# EAGLE design BallDetector6A (EAGLE 6.5.0)
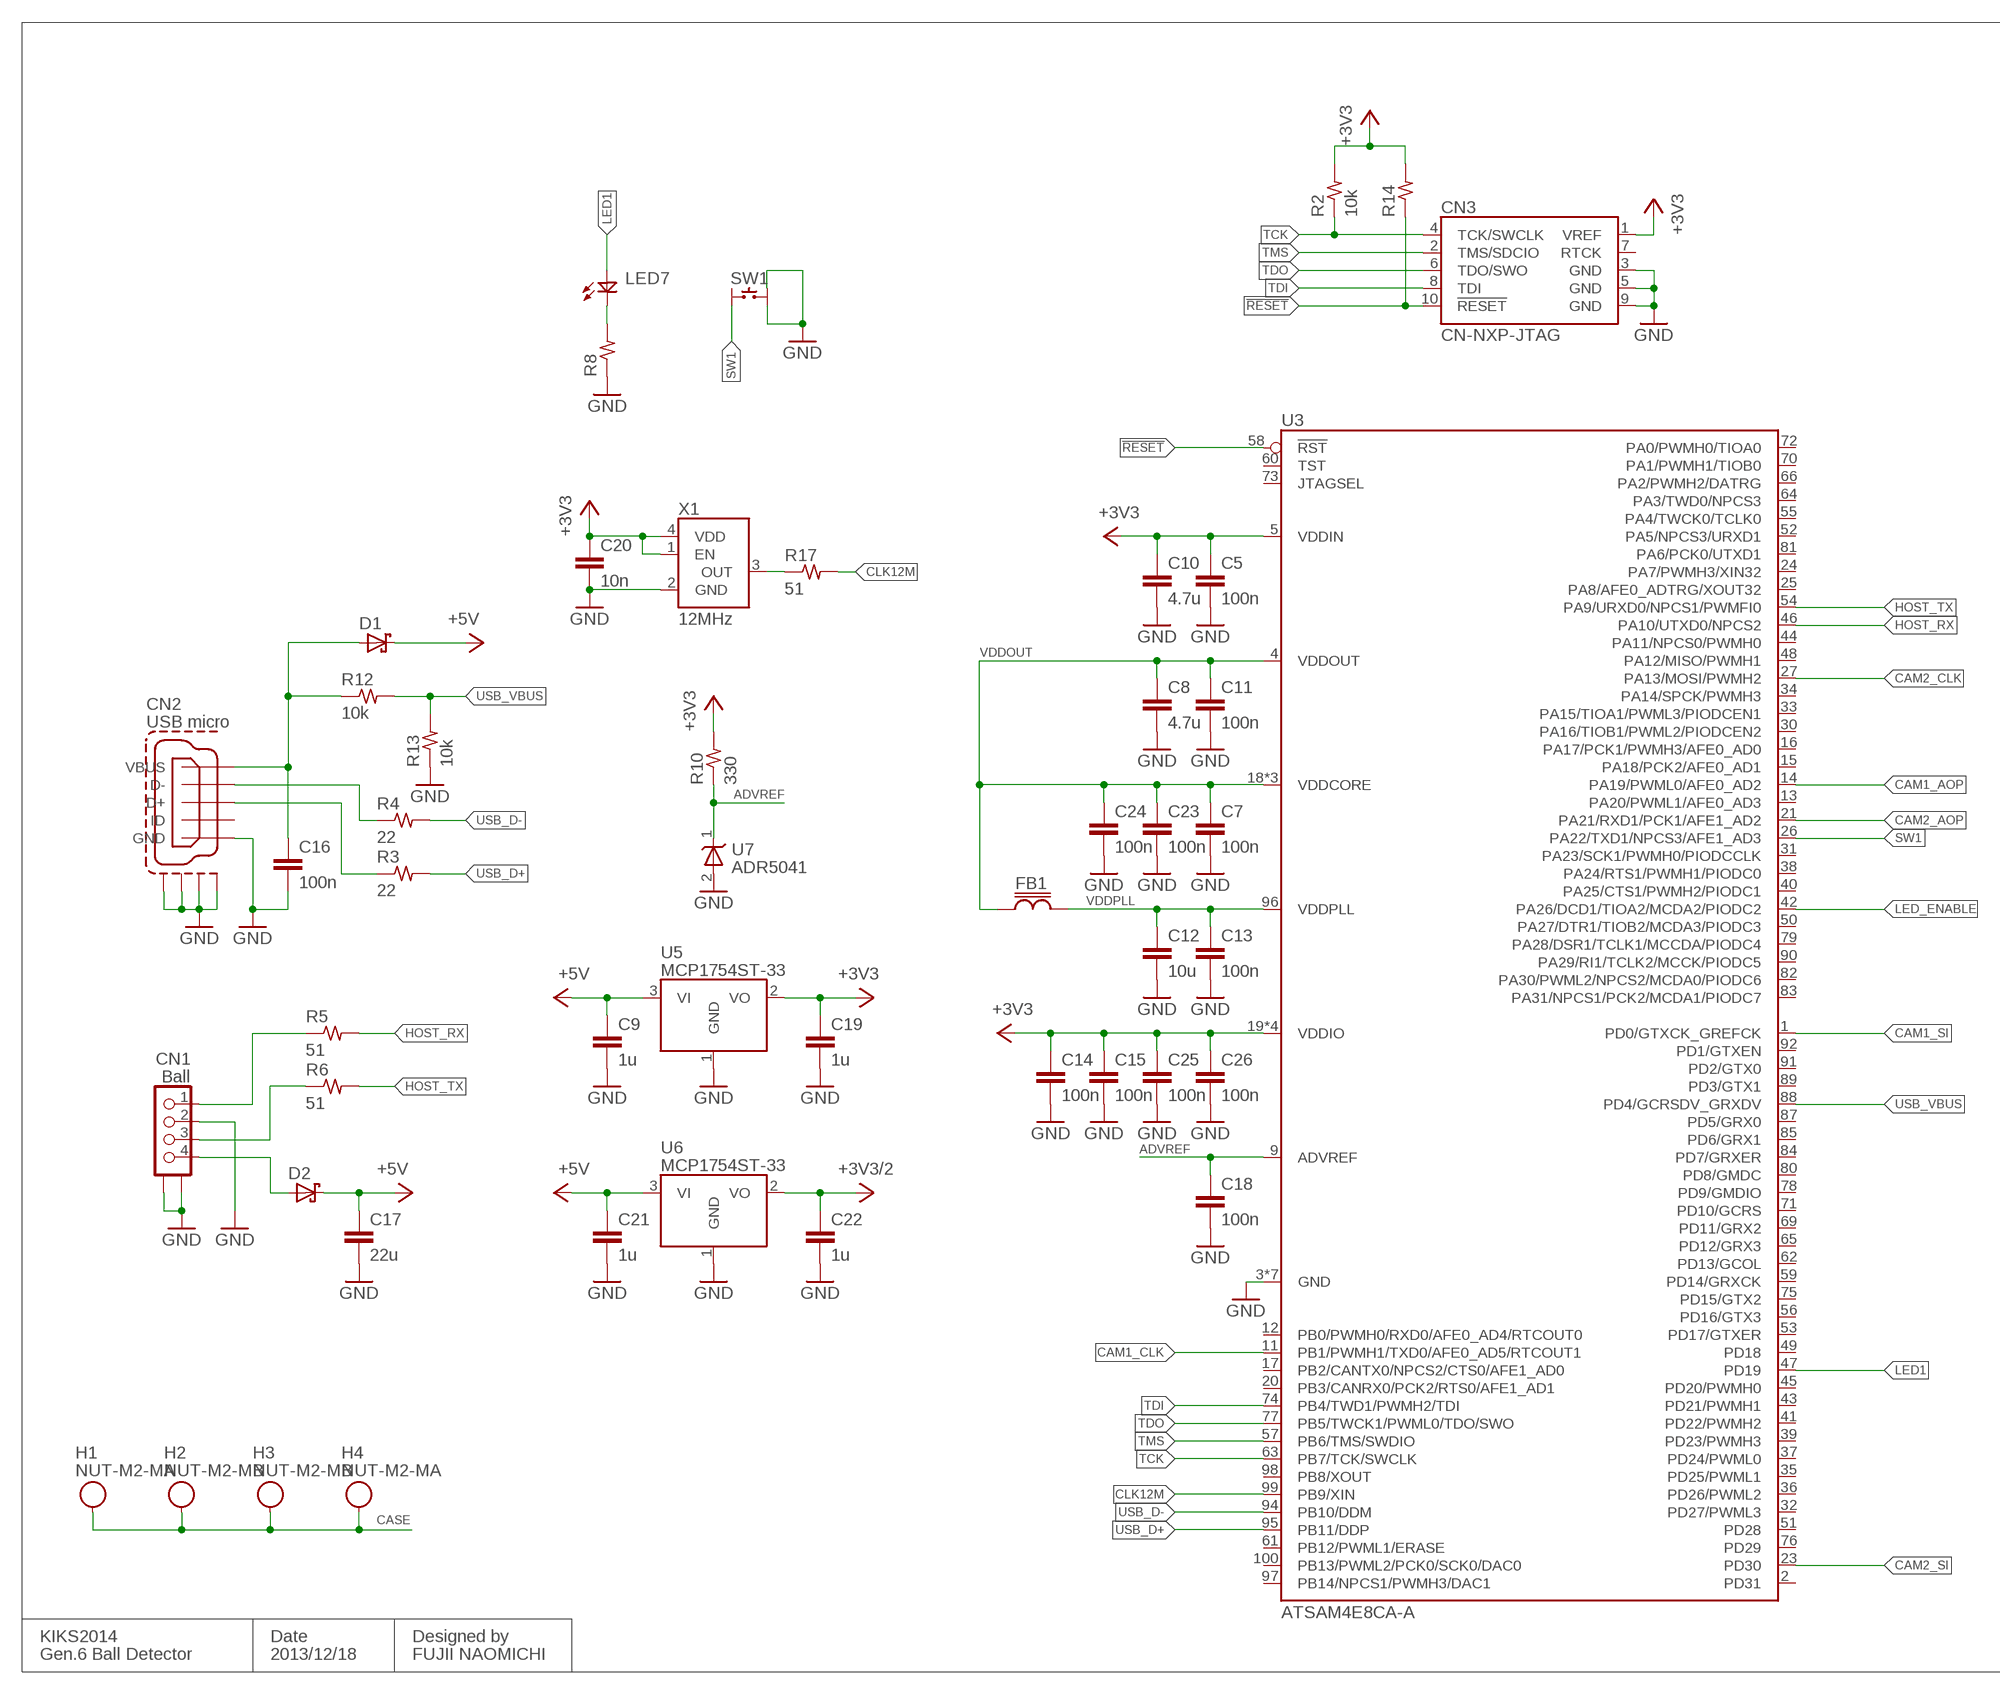
[diagram p0: schematic, sheet 1, part 1 of 2]
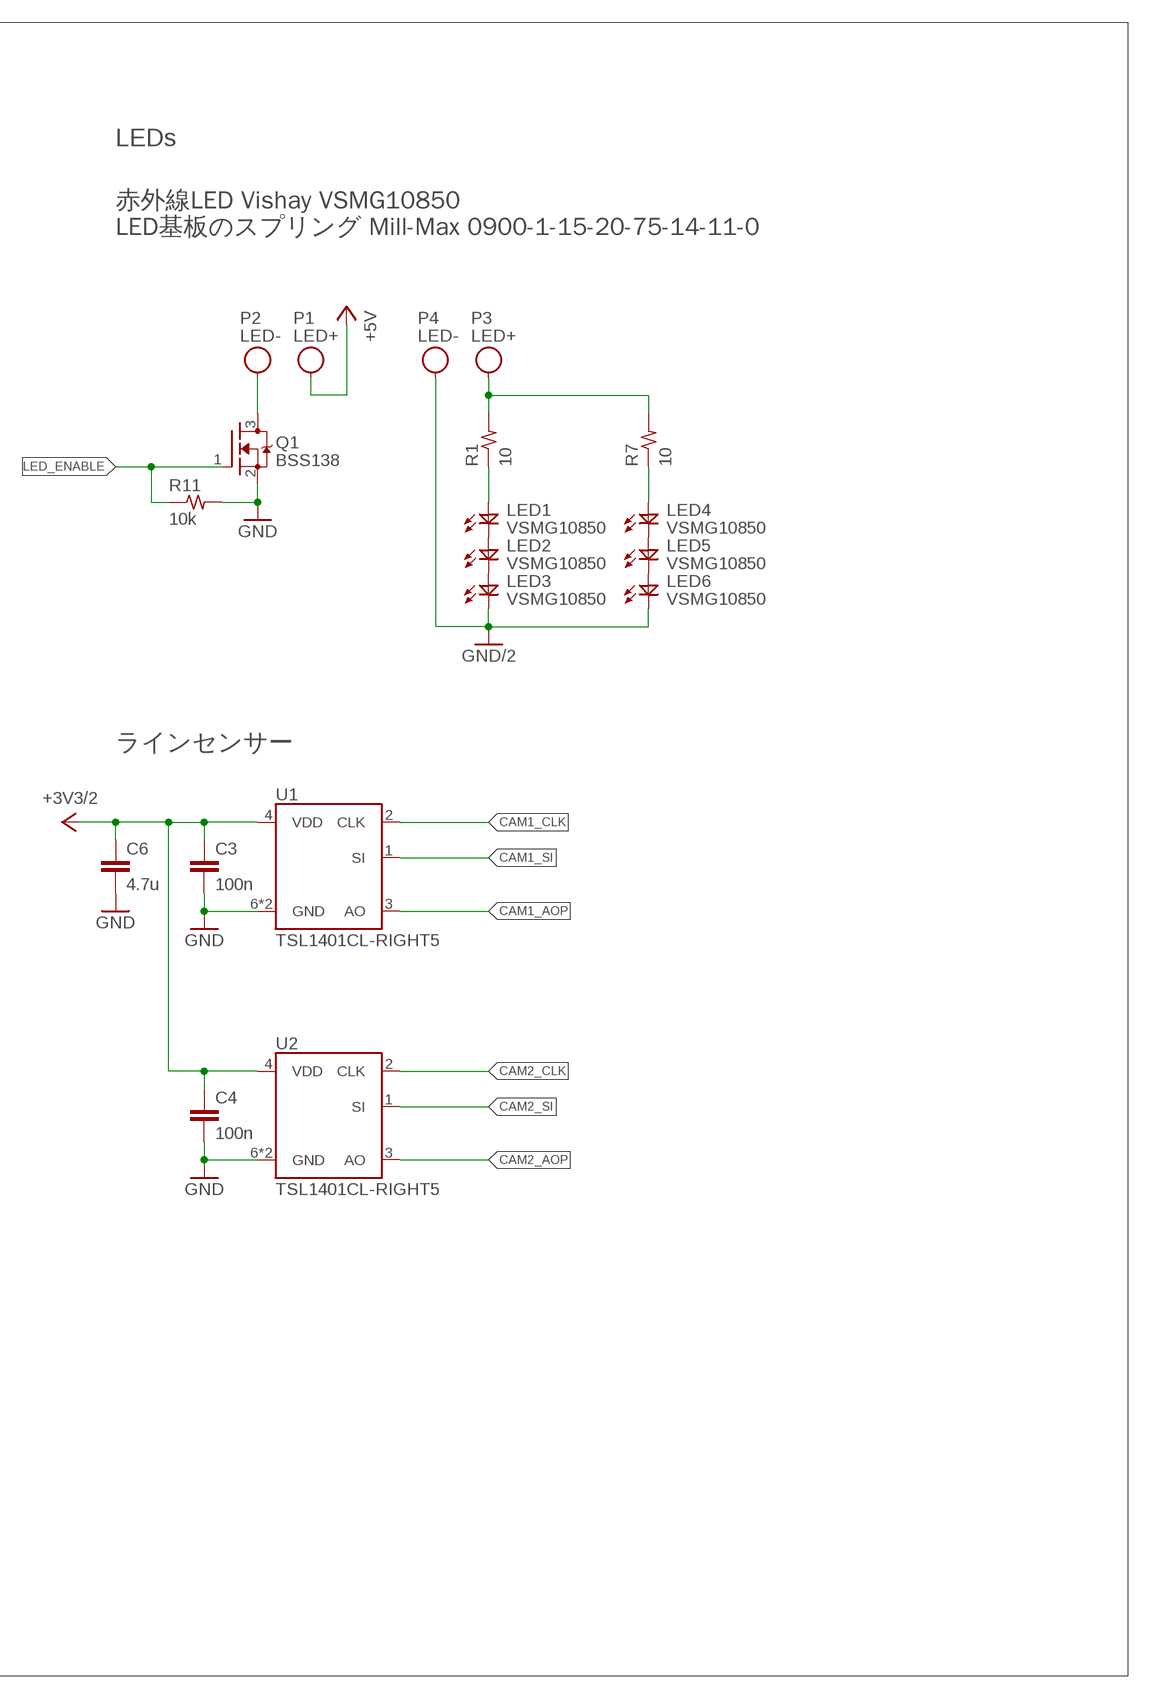
[diagram p1: schematic, sheet 1, part 2 of 2]

## Parts
C3  100n  C1005  [1005]
C4  100n  C1005  [1005]
C5  100n  C1005  [1005]
C6  4.7u  C1608  [1608]
C7  100n  C1005  [1005]
C8  4.7u  C1608  [1608]
C9  1u  C1005  [1005]
C10  4.7u  C1608  [1608]
C11  100n  C1005  [1005]
C12  10u  C1005  [1005]
C13  100n  C1005  [1005]
C14  100n  C1005  [1005]
C15  100n  C1005  [1005]
C16  100n  C1005  [1005]
C17  22u  C2012  [2012]
C18  100n  C1005  [1005]
C19  1u  C1005  [1005]
C20  10n  C1005  [1005]
C21  1u  C1005  [1005]
C22  1u  C1005  [1005]
C23  100n  C1005  [1005]
C24  100n  C1005  [1005]
C25  100n  C1005  [1005]
C26  100n  C1005  [1005]
CN1  Ball  53398-0471  [53398-04]
CN2  USB micro  ZX62-B-5PA  [ZX62-B-5PA]
CN3  CN-NXP-JTAG  [PIN2X5-SMT1.27]
D1  SBD-SOD523  [SOD523]
D2  SBD-SOD523  [SOD523]
FB1  FB1608  [1608]
H1  NUT-M2-MA  [NUT-M2-MA]
H2  NUT-M2-MB  [NUT-M2-MB]
H3  NUT-M2-MB  [NUT-M2-MB]
H4  NUT-M2-MA  [NUT-M2-MA]
LED1  VSMG10850  [3010]
LED2  VSMG10850  [3010]
LED3  VSMG10850  [3010]
LED4  VSMG10850  [3010]
LED5  VSMG10850  [3010]
LED6  VSMG10850  [3010]
LED7  LED1608  [1608]
P1  LED+  SPRING-72MIL  [SPRING-72MIL]
P2  LED-  SPRING-72MIL  [SPRING-72MIL]
P3  LED+  SPRING-72MIL  [SPRING-72MIL]
P4  LED-  SPRING-72MIL  [SPRING-72MIL]
Q1  BSS138  MOS-N-SOT23  [SOT23-3]
R1  10  R1608  [1608]
R2  10k  R1005  [1005]
R3  22  R1005  [1005]
R4  22  R1005  [1005]
R5  51  R1005  [1005]
R6  51  R1005  [1005]
R7  10  R1608  [1608]
R8  R1005  [1005]
R10  330  R1005  [1005]
R11  10k  R1005  [1005]
R12  10k  R1005  [1005]
R13  10k  R1005  [1005]
R14  R1005  [1005]
R17  51  R1005  [1005]
SW1  SKRP  [SKRP]
U1  TSL1401CL-RIGHT5  [TSL1401CL-RIGHT5]
U2  TSL1401CL-RIGHT5  [TSL1401CL-RIGHT5]
U3  ATSAM4E8CA-A  [QFP100-0.5]
U5  MCP1754ST-33  [SOT23-3]
U6  MCP1754ST-33  [SOT23-3]
U7  ADR5041  [SC70-3]
X1  12MHz  ASDMB  [OSC2520]

## Nets
!RESET: CN3.10(!RESET) R14.1 U3.58(!RST)
+3V3: C5.1 C10.1 C14.1 C15.1 C19.1 C20.1 C25.1 C26.1 CN3.1(VREF) R2.2 R10.2 R14.2 U3.5(VDDIN) U3.19(VDDIO) U3.28(VDDIO) U3.68(VDDIO) U3.93(VDDIO) U5.2(VO) X1.1(EN) X1.4(VDD)
+3V3/2: C3.1 C4.1 C6.1 C22.1 U1.4(VDD) U2.4(VDD) U6.2(VO)
+5V: C9.1 C17.1 C21.1 D1.K D2.K P1.1 U5.3(VI) U6.3(VI)
ADVREF: C18.1 R10.1 U3.9(ADVREF) U7.1(K)
CAM1_AOP: U1.3(AO) U3.14(PA19/PWML0/AFE0_AD2)
CAM1_CLK: U1.2(CLK) U3.11(PB1/PWMH1/TXD0/AFE0_AD5/RTCOUT1)
CAM1_SI: U1.1(SI) U3.1(PD0/GTXCK_GREFCK)
CAM2_AOP: U2.3(AO) U3.21(PA21/RXD1/PCK1/AFE1_AD2)
CAM2_CLK: U2.2(CLK) U3.27(PA13/MOSI/PWMH2)
CAM2_SI: U2.1(SI) U3.23(PD30)
CASE: H1.1 H1.2 H2.1 H2.2 H3.1 H3.2 H4.1 H4.2
CLK12M: R17.2 U3.99(PB9/XIN)
GND: C3.2 C4.2 C5.2 C6.2 C7.2 C8.2 C9.2 C10.2 C11.2 C12.2 C13.2 C14.2 C15.2 C16.2 C17.2 C18.2 C19.2 C20.2 C21.2 C22.2 C23.2 C24.2 C25.2 C26.2 CN1.2 CN1.S1 CN1.S2 CN2.5(GND) CN2.S1 CN2.S2 CN2.S3 CN2.S4 CN3.3(GND) CN3.5(GND) CN3.9(GND) Q1.2(S) R8.1 R11.2 R13.1 SW1.B1 SW1.B2 U1.6(GND) U1.7(GND) U2.6(GND) U2.7(GND) U3.3(GND) U3.6(GND) U3.7(GND) U3.8(GND) U3.10(GND) U3.29(GND) U3.67(GND) U5.1(GND) U6.1(GND) U7.2(A) X1.2(GND)
GND/2: LED3.K LED6.K P4.1
HOST_RX: R5.2 U3.46(PA10/UTXD0/NPCS2)
HOST_TX: R6.2 U3.54(PA9/URXD0/NPCS1/PWMFI0)
LED1: LED7.A U3.47(PD19)
LED_ENABLE: Q1.1(G) R11.1 U3.42(PA26/DCD1/TIOA2/MCDA2/PIODC2)
N$1: LED1.K LED2.A
N$2: LED2.K LED3.A
N$3: P3.1 R1.2 R7.2
N$4: LED4.K LED5.A
N$5: LED5.K LED6.A
N$6: LED4.A R7.1
N$7: LED1.A R1.1
N$8: P2.1 Q1.3(D)
N$9: CN2.2(D-) R4.1
N$10: CN2.3(D+) R3.1
N$11: C16.1 CN2.1(VBUS) D1.A R12.1
N$12: R17.1 X1.3(OUT)
N$14: CN1.1 R5.1
N$15: CN1.3 R6.1
N$16: CN1.4 D2.A
N$17: LED7.K R8.2
SW1: SW1.A2 U3.26(PA22/TXD1/NPCS3/AFE1_AD3)
TCK: CN3.4(TCK/SWCLK) R2.1 U3.63(PB7/TCK/SWCLK)
TDI: CN3.8(TDI) U3.74(PB4/TWD1/PWMH2/TDI)
TDO: CN3.6(TDO/SWO) U3.77(PB5/TWCK1/PWML0/TDO/SWO)
TMS: CN3.2(TMS/SDCIO) U3.57(PB6/TMS/SWDIO)
USB_D+: R3.2 U3.95(PB11/DDP)
USB_D-: R4.2 U3.94(PB10/DDM)
USB_VBUS: R12.2 R13.2 U3.88(PD4/GCRSDV_GRXDV)
VDDOUT: C7.1 C8.1 C11.1 C23.1 C24.1 FB1.1 U3.4(VDDOUT) U3.18(VDDCORE) U3.22(VDDCORE) U3.86(VDDCORE)
VDDPLL: C12.1 C13.1 FB1.2 U3.96(VDDPLL)
Unconnected: CN2.4(ID) CN3.7(RTCK) SW1.A1 U3.2(PD31) U3.12(PB0/PWMH0/RXD0/AFE0_AD4/RTCOUT0) U3.13(PA20/PWML1/AFE0_AD3) U3.15(PA18/PCK2/AFE0_AD1) U3.16(PA17/PCK1/PWMH3/AFE0_AD0) U3.17(PB2/CANTX0/NPCS2/CTS0/AFE1_AD0) U3.20(PB3/CANRX0/PCK2/RTS0/AFE1_AD1) U3.24(PA7/PWMH3/XIN32) U3.25(PA8/AFE0_ADTRG/XOUT32) U3.30(PA16/TIOB1/PWML2/PIODCEN2) U3.31(PA23/SCK1/PWMH0/PIODCCLK) U3.32(PD27/PWML3) U3.33(PA15/TIOA1/PWML3/PIODCEN1) U3.34(PA14/SPCK/PWMH3) U3.35(PD25/PWML1) U3.36(PD26/PWML2) U3.37(PD24/PWML0) U3.38(PA24/RTS1/PWMH1/PIODC0) U3.39(PD23/PWMH3) U3.40(PA25/CTS1/PWMH2/PIODC1) U3.41(PD22/PWMH2) U3.43(PD21/PWMH1) U3.44(PA11/NPCS0/PWMH0) U3.45(PD20/PWMH0) U3.48(PA12/MISO/PWMH1) U3.49(PD18) U3.50(PA27/DTR1/TIOB2/MCDA3/PIODC3) U3.51(PD28) U3.52(PA5/NPCS3/URXD1) U3.53(PD17/GTXER) U3.55(PA4/TWCK0/TCLK0) U3.56(PD16/GTX3) U3.59(PD14/GRXCK) U3.60(TST) U3.61(PB12/PWML1/ERASE) U3.62(PD13/GCOL) U3.64(PA3/TWD0/NPCS3) U3.65(PD12/GRX3) U3.66(PA2/PWMH2/DATRG) U3.69(PD11/GRX2) U3.70(PA1/PWMH1/TIOB0) U3.71(PD10/GCRS) U3.72(PA0/PWMH0/TIOA0) U3.73(JTAGSEL) U3.75(PD15/GTX2) U3.76(PD29) U3.78(PD9/GMDIO) U3.79(PA28/DSR1/TCLK1/MCCDA/PIODC4) U3.80(PD8/GMDC) U3.81(PA6/PCK0/UTXD1) U3.82(PA30/PWML2/NPCS2/MCDA0/PIODC6) U3.83(PA31/NPCS1/PCK2/MCDA1/PIODC7) U3.84(PD7/GRXER) U3.85(PD6/GRX1) U3.87(PD5/GRX0) U3.89(PD3/GTX1) U3.90(PA29/RI1/TCLK2/MCCK/PIODC5) U3.91(PD2/GTX0) U3.92(PD1/GTXEN) U3.97(PB14/NPCS1/PWMH3/DAC1) U3.98(PB8/XOUT) U3.100(PB13/PWML2/PCK0/SCK0/DAC0)

## Notes on the sheet
- LEDs
- 赤外線LED Vishay VSMG10850
  LED基板のスプリング Mill-Max 0900-1-15-20-75-14-11-0
- ラインセンサー
- KIKS2014 | Date | Designed by
- Gen.6 Ball Detector | 2013/12/18 | FUJII NAOMICHI

## Library data of the parts
C3-C26 = Passive:C
CN1 = con-Molex:53398-0471
CN2 = con-Hirose:ZX62-B-5PA
CN3 = Connector:CN-NXP-JTAG
D1 D2 = Diode:SBD-*
FB1 = Passive:FB
H1-H4 = ProjectOnly:NUT-*
LED1-LED6 = ic-Vishay:VSMG10850
LED7 = Opto:LED
P1-P4 = ProjectOnly:SPRING-*
Q1 = Transistor:MOS-N-*
R1-R8 R10-R14 R17 = Passive:R
SW1 = Switch:SKRP
U1 U2 = ic-ams:TSL1401CL
U3 = ic-ATMEL:ATSAM4E*CA-?
U5 U6 = ic-Microchip:MCP1754ST-*
U7 = ic-AD:ADR504*
X1 = Oscillator:ASDM

## Board
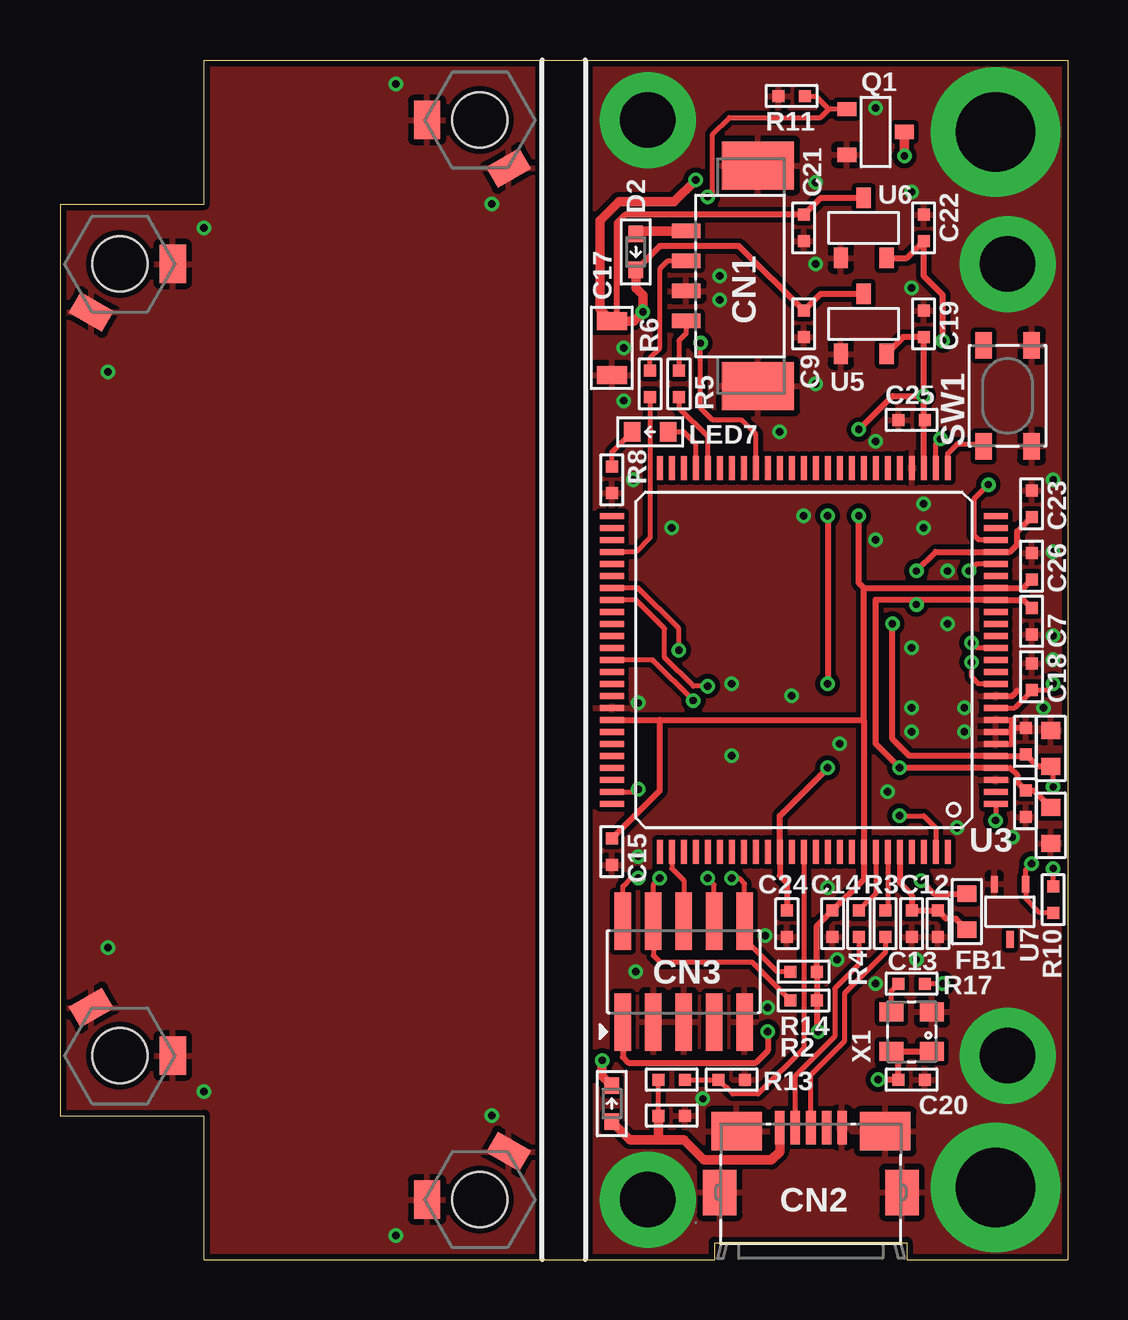
[diagram p2: board, top side]
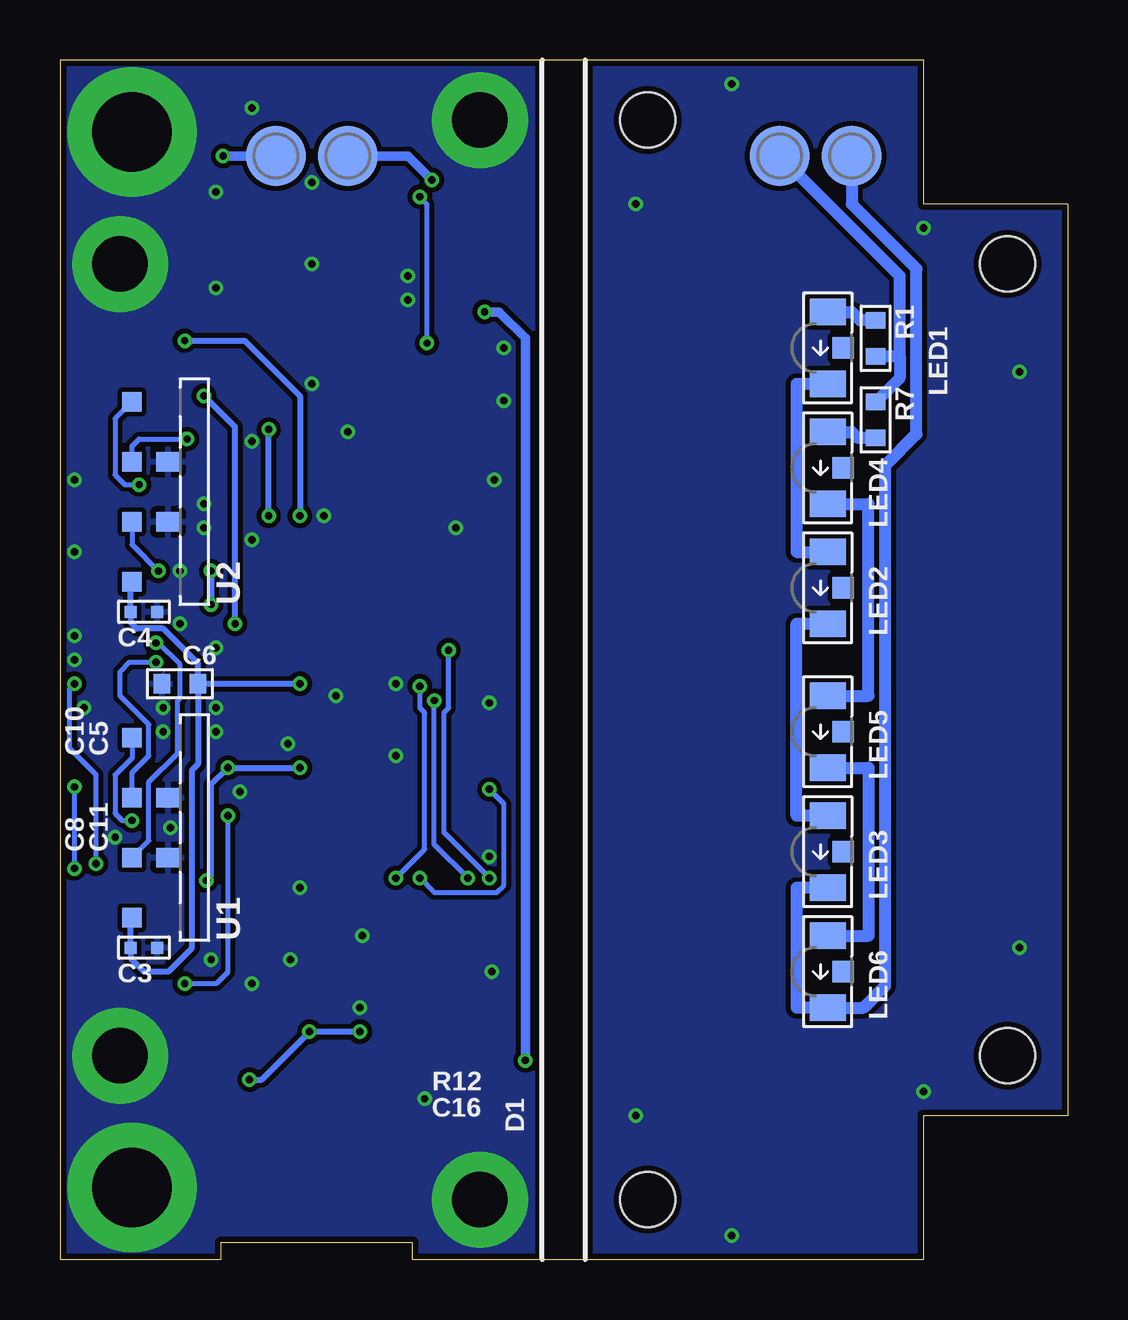
[diagram p3: board, bottom side, seen from below]

Size 42 x 50 mm. Coordinates in mm from the lower left corner, seen from the top.
Outline: 42,50 42,0 35.3,0 35.3,0.7 27.3,0.7 27.3,0 6,0 6,6 0,6 0,44 6,44 6,50 42,50
Copper layers (1*16): Top 0.035mm / dielectric 0.6mm / Bottom 0.035mm
Design rules "FusionPCB *": minimum track width 6mil, minimum drill 0.3mm, track to track 6mil, track to pad 6mil, pad to pad 6mil, via to via 6mil, smd to smd 6mil, copper to edge 10mil, drill to drill 10mil, minimum pad ring 0.2mm, minimum via ring 6mil, stop-mask expansion 4mil, vias tented up to drill 3mm, thermal gap 10mil
tKeepout: area -10.1,0 to -9.3,50; area -5.2,0 to -4.4,50

### Footprints (pad centres in the part's own frame; a part is rotated, then mirrored left to right if it is on the bottom)
1005 = smd 0.5 x 0.5: 1 -0.55,0; 2 0.55,0
1608 = smd 0.7 x 0.8: 1 -0.75,0; 2 0.75,0
2012 = smd 0.75 x 1.25: 1 -1.125,0; 2 1.125,0
53398-04 = smd 0.6 x 1.2: 1 1.875,-0.9; 2 0.625,-0.9; 3 -0.625,-0.9; 4 -1.875,-0.9 | smd 2 x 3: S1 4.6,2.1; S2 -4.6,2.1
ZX62-B-5PA = smd 1.4 x 0.4: 1 2.7,1.3; 2 2.7,0.65; 3 2.7,0; 4 2.7,-0.65; 5 2.7,-1.3 | smd 1.9 x 1.4: S1 0,-3.8; S2 0,3.8 | smd 1.6 x 2.1: S3 2.55,3.1; S4 2.55,-3.1
PIN2X5-SMT1.27 = smd 0.7 x 2.4: 1 -2.54,-2.1; 2 -2.54,2.1; 3 -1.27,-2.1; 4 -1.27,2.1; 5 0,-2.1; 6 0,2.1; 7 1.27,-2.1; 8 1.27,2.1; 9 2.54,-2.1; 10 2.54,2.1
SOD523 = smd 0.7 x 0.6: A 0.75,0; K -0.75,0
NUT-M2-MA = smd 1.6 x 1 rotated 60: 1 -2,1.2 | smd 1.6 x 1.1: 2 0,-2.2 | hole 2.3: 0,0
NUT-M2-MB = smd 1.6 x 1 rotated 300: 1 2,1.2 | smd 1.6 x 1.1: 2 0,-2.2 | hole 2.3: 0,0
3010 = smd 1.1 x 1.5: A 1.5,0; K -1.5,0 | smd 0.9 x 0.9: R 0,-0.65
1608' = smd 0.7 x 0.8: A 0.75,0; K -0.75,0
SPRING-72MIL = smd 2.5 x 2.5: 1 0,0
SOT23-3 = smd 0.6 x 0.8: 1 -0.95,-1.2; 2 0.95,-1.2; 3 0,1.2
SKRP = smd 1.1 x 0.7: A1 -2.1,-1; A2 2.1,-1; B1 -2.1,1; B2 2.1,1
TSL1401CL-RIGHT5 = smd 0.8 x 0.8: 1 -3.75,-2; 2 -1.25,-2; 3 1.25,-2; 4 3.75,-2 | smd 0.8 x 1: 6 1.25,-0.5; 7 -1.25,-0.5
QFP100-0.5 = smd 1 x 0.25: 1 -8,6; 2 -8,5.5; 3 -8,5; 4 -8,4.5; 5 -8,4; 6 -8,3.5; 7 -8,3; 8 -8,2.5; 9 -8,2; 10 -8,1.5; 11 -8,1; 12 -8,0.5; 13 -8,0; 14 -8,-0.5; 15 -8,-1; 16 -8,-1.5; 17 -8,-2; 18 -8,-2.5; 19 -8,-3; 20 -8,-3.5; 21 -8,-4; 22 -8,-4.5; 23 -8,-5; 24 -8,-5.5; 25 -8,-6; 51 8,-6; 52 8,-5.5; 53 8,-5; 54 8,-4.5; 55 8,-4; 56 8,-3.5; 57 8,-3; 58 8,-2.5; 59 8,-2; 60 8,-1.5; 61 8,-1; 62 8,-0.5; 63 8,0; 64 8,0.5; 65 8,1; 66 8,1.5; 67 8,2; 68 8,2.5; 69 8,3; 70 8,3.5; 71 8,4; 72 8,4.5; 73 8,5; 74 8,5.5; 75 8,6 | smd 0.25 x 1: 26 -6,-8; 27 -5.5,-8; 28 -5,-8; 29 -4.5,-8; 30 -4,-8; 31 -3.5,-8; 32 -3,-8; 33 -2.5,-8; 34 -2,-8; 35 -1.5,-8; 36 -1,-8; 37 -0.5,-8; 38 0,-8; 39 0.5,-8; 40 1,-8; 41 1.5,-8; 42 2,-8; 43 2.5,-8; 44 3,-8; 45 3.5,-8; 46 4,-8; 47 4.5,-8; 48 5,-8; 49 5.5,-8; 50 6,-8; 76 6,8; 77 5.5,8; 78 5,8; 79 4.5,8; 80 4,8; 81 3.5,8; 82 3,8; 83 2.5,8; 84 2,8; 85 1.5,8; 86 1,8; 87 0.5,8; 88 0,8; 89 -0.5,8; 90 -1,8; 91 -1.5,8; 92 -2,8; 93 -2.5,8; 94 -3,8; 95 -3.5,8; 96 -4,8; 97 -4.5,8; 98 -5,8; 99 -5.5,8; 100 -6,8
SOT23-3' = smd 0.6 x 0.85: 1 -0.95,-1.25; 2 0.95,-1.25; 3 0,1.25
SC70-3 = smd 0.3 x 0.7: 1 -0.65,-1.15; 2 0.65,-1.15; 3 0,1.15
OSC2520 = smd 0.8 x 1: 1 -0.825,-0.85; 2 0.825,-0.85; 3 0.825,0.85; 4 -0.825,0.85

### Placement (x,y rotation side)
C3  38.5,13 0 bottom
C4  38.5,27 0 bottom
C5  40.25,21.6 90 top
C6  37,24 180 bottom
C7  40.5,26.6 270 top
C8  41.3,18.1 270 top
C9  31,39 270 top
C10  41.3,21.3 90 top
C11  40.25,19 270 top
C12  36.6,14 270 top
C13  35.5,14 270 top
C14  32.2,14 270 top
C15  23,17 270 top
C16  25.5,6 0 top
C17  23,38 270 top
C18  40.5,24.3 90 top
C19  36,39 90 top
C20  35.5,7.5 0 top
C21  31,43 270 top
C22  36,43 90 top
C23  40.5,31.5 90 top
C24  30.3,14 270 top
C25  35.5,35 180 top
C26  40.5,28.9 90 top
CN1  27,41 270 top
CN2  31.3,2.8 90 top
CN3  26,12 0 top
D1  23,6.5 270 top
D2  24,42 90 top
FB1  37.8,14.5 270 top
H1  17.5,2.5 270 top
H2  17.5,47.5 270 top
H3  2.5,8.5 90 top
H4  2.5,41.5 90 top
LED1  10,38 90 bottom
LED2  10,28 90 bottom
LED3  10,17 90 bottom
LED4  10,33 90 bottom
LED5  10,22 90 bottom
LED6  10,12 90 bottom
LED7  [1608']  24.6,34.5 0 top
P1  30,46 0 bottom
P2  33,46 0 bottom
P3  12,46 0 bottom
P4  9,46 0 bottom
Q1  34,47 270 top
R1  8,38.4 270 bottom
R2  31,10.8 0 top
R3  34.4,14 90 top
R4  33.3,14 90 top
R5  25.8,36.5 270 top
R6  24.6,36.5 270 top
R7  8,35 90 bottom
R8  23,32.5 90 top
R10  41.4,15 90 top
R11  30.5,48.5 180 top
R12  25.5,7.5 0 top
R13  28,7.5 180 top
R14  31,12 0 top
R17  35.5,11.5 0 top
SW1  39.5,36 270 top
U1  37,18 270 bottom
U2  37,32 270 bottom
U3  31,25 180 top
U5  MCP1754ST-33  [SOT23-3']  33.5,39 0 top
U6  MCP1754ST-33  [SOT23-3']  33.5,43 0 top
U7  39.6,14.5 180 top
X1  35.5,9.5 90 top

### Tracks (layer width: path | path; a pad name or v marks a point on that pad's centre or on a via)
!RESET  (via drill 0.3)
  Top 0.2: R14.1 29.9,12 28.54,13.36 CN3.10 28.54,15.66 28.3,15.9 v28,15.9 | v27,23.9 26.4,23.9 25.2,25.1 25.2,26.3 24,27.5 U3.58
  Bottom 0.2: v28,15.9 26.8,17.1 26.8,22.8 27,23 v27,23.9
+3V3  (via drill 0.3)
  Top 0.2: R10.2 v41.4,16.3 | v41.4,19.7 41.4,20.45 C10.1
  Top 0.25: U3.68 25,22.5 | 25,22.5 33.5,22.5 | 33.5,22.5 U3.93 33.5,15.85 C14.1 31.55,13.9 R14.2 R2.2 31.55,9.55 v31.6,9.5 | 33.5,22.5 33.5,28 | 33.5,28 U3.19 40.15,28 C26.1 | 33.5,28 33.3,28.2 v33.3,31 | 34.5,37.7 U5.2 35.15,38.45 C19.1 v36,36 | U3.28 36,34.95 C25.1 36,35.05 v36,36 | v34.7,26.5 34.7,21.7 35.4,21 U3.5 40.2,21 C5.1 40.75,20.55 C10.1 | v33.3,34.6 34.7,36 v36,36 | C15.1 25,19.55 25,22.5 | v34.1,7.5 C20.1 34.95,8.38 X1.4 X1.1 | CN3.1 23.46,8.44 23.7,8.2 29,8.2 29.5,8.7 v29.5,9.5
  Bottom 0.2: v41.4,19.7 v41.4,16.3
  Bottom 0.25: v33.3,31 v33.3,34.6 | v34.7,26.5 34.7,34.7 v36,36 | v34.1,7.5 33.6,7.5 v31.6,9.5 v29.5,9.5
+3V3/2  (via drill 0.3)
  Top 0.25: U6.2 35.3,41.75 C22.1 36,41 36.8,40.2 v36.8,38.3 | v32,31 v32,24
  Bottom 0.25: U2.4 39.05,28.2 C4.1 39.05,26.55 38.8,26.3 37.7,26.3 36.25,24.85 C6.1 | U1.4 39.05,14.2 C3.1 39.05,12.55 38.5,12 37.5,12 36.5,13 36.5,20.4 36.25,20.65 C6.1 | v36.8,38.3 34.3,38.3 32,36 v32,31 | v32,24 C6.1
+5V  (via drill 0.3)
  Top 0.25: U6.3 31.7,44.25 C21.1 23.55,43.55 23.2,43.2 23.2,39.33 C17.1 | U5.3 31.7,40.25 C9.1 28.3,42.25 25,42.25 D2.K
  Top 0.4: D2.K 24,40.5 24.3,40.2 v24.3,39.5 23.93,39.12 C17.1 22.5,39.62 22.5,43.3 23.3,44.1 25.6,44.1 v26.5,45 | v22.6,8.3 22.6,7.65 D1.K
  Bottom 0.4: v22.6,8.3 22.6,38.4 23.7,39.5 v24.3,39.5 | P1.1 27.5,46 v26.5,45
ADVREF  (via drill 0.3)
  Top 0.2: v40.5,16.5 40.25,16.25 U7.1 40.25,15.05 40.85,14.45 R10.1 | U3.9 39.8,23 40.5,23.7 C18.1 41.15,23.75 v41.4,24
  Bottom 0.2: v40.5,16.5 40.5,20.2 41.6,21.3 41.6,23.8 v41.4,24
CAM1_AOP  (via drill 0.3)
  Top 0.2: U3.14 38.2,25.5 v38,25.7
  Bottom 0.2: U1.3 38.3,17.45 38.3,19.9 37.1,21.1 37.1,23.3 37,23.4 37,24.8 37.9,25.7 v38,25.7
CAM1_CLK  (via drill 0.3)
  Top 0.2: U3.11 38.3,24 38,24.3 v38,24.9
  Bottom 0.2: U1.2 39,20.3 38.3,21 38.3,22.3 39.5,23.5 39.5,24.5 39.1,24.9 v38,24.9
CAM1_SI  (via drill 0.3)
  Top 0.2: U3.1 v39,18.3
  Bottom 0.2: U1.1 39,20.9 39.7,20.2 39.7,18.6 39.4,18.3 v39,18.3
CAM2_AOP  (via drill 0.3)
  Top 0.2: U3.21 38.2,29 v37.9,28.7
  Bottom 0.2: U2.3 39,29.8 v37.9,28.7
CAM2_CLK  (via drill 0.3)
  Top 0.2: U3.27 36.5,34 v36.7,34.2
  Bottom 0.2: U2.2 39,33.9 38.7,34.2 v36.7,34.2
CAM2_SI  (via drill 0.3)
  Top 0.2: U3.23 38.3,30 38.1,30.2 38.1,31.7 v38.7,32.3
  Bottom 0.2: U2.1 39.7,35.05 39.7,32.7 39.3,32.3 v38.7,32.3
CASE  (via drill 0.3)
  other vias: 2,37 18,44 18,6 2,13 6,7 6,43 14,49 14,1
  pour Top (isolate 0.2, rank 6): 0.3,43.7 6.3,43.7 6.3,49.7 19.7,49.7 19.7,0.3 6.3,0.3 6.3,6.3 0.3,6.3
  pour Bottom (isolate 0.2, rank 6): 0.3,43.7 6.3,43.7 6.3,49.7 19.7,49.7 19.7,0.3 6.3,0.3 6.3,6.3 0.3,6.3
CLK12M  (via drill 0.3)
  Top 0.2: v36.8,11.5 R17.2 | v35,18.5 36,18.5 36.5,18 U3.99
  Bottom 0.2: v35,18.5 35,12 35.5,11.5 v36.8,11.5
GND  (via drill 0.3, 2.3 pad 4, 3.3 pad 5.4)
  Top 0.25: U3.10 39.7,23.5 39.9,23.7 | U3.7 39.7,22 | U3.8 39.7,22.5 39.7,22.15 | U3.6 39.7,21.5 39.7,22 | 39.7,22 39.7,22.15 | C5.2 39.7,22.15
  other vias: 39,3 39,47 24.5,47.5 24.5,2.5 39.5,41.5 39.5,8.5 41.4,25 41.4,29.5 41,23 24.1,23.2 24.1,16.8 24,12 29.5,10.5 34.5,19.5 39.7,17.6 35.7,12.5 34,11.5 29.4,13.5 36,31.5 41.4,32.5 41.4,26 32.5,21.5 30.5,23.5 25.5,30.5 30,34.5 31.5,36.5 31.5,41.5 35.5,44.5 35.5,40.5 23.5,38 23.5,35.8 27.5,41 27.5,40 37,26.5 36,30.5 32.4,12.5 37.4,18 31.5,44.9 34,48 23.9,32.5 35.5,23 37.7,22 37.7,23 26.8,6.7 34,30 35.5,25.5 31,31 28,24 28,21 32,15.5 37,28.7 34,34.1 35.5,22
  pour Top (isolate 0.2, rank 6): 41.7,49.7 22.3,49.7 22.3,0.3 41.7,0.3
  pour Bottom (isolate 0.2, rank 6): 41.7,49.7 22.3,49.7 22.3,0.3 41.7,0.3
GND/2
  Bottom 0.5: LED3.K 11.3,15.5 11.3,10.5 LED6.K 8.5,10.5 7.6,11.4 7.6,33.1 6.3,34.4 6.3,41.3 9,44 P4.1
HOST_RX
  Top 0.2: U3.46 27,34.3 25.8,35.5 R5.2
HOST_TX
  Top 0.2: U3.54 24,29.5 24.6,30.1 R6.2
LED1
  Top 0.2: U3.47 26.5,34 26,34.5 LED7.A
LED_ENABLE  (via drill 0.3)
  Top 0.2: U3.42 29,34.4 28.4,35 27.2,35 26.7,35.5 v26.7,38.2 | v27,44.3 27.2,44.5 27.2,46.9 27.9,47.6 31.7,47.6 32.05,47.95 | Q1.1 32.05,47.95 | R11.1 31.5,48.5 32.05,47.95
  Bottom 0.2: v26.7,38.2 26.7,44 v27,44.3
N$1
  Bottom 0.5: LED1.K 11.3,36.5 11.3,29.5 LED2.A
N$2
  Bottom 0.5: LED2.K 11.3,26.5 11.3,18.5 LED3.A
N$3
  Bottom 0.5: P3.1 7,41 7,37.65 | R1.2 7,37.65 | 7,37.65 7,36.75 R7.2
N$4
  Bottom 0.5: LED5.A 8.3,23.5 8.3,31.5 LED4.K
N$5
  Bottom 0.5: LED5.K 8.3,20.5 8.3,13.5 LED6.A
N$6
  Bottom 0.5: LED4.A 9,34.5 8.75,34.25 R7.1
N$7
  Bottom 0.5: LED1.A 9,39.5 8.65,39.15 R1.1
N$8  (via drill 0.3)
  Top 0.4: Q1.3 v35.2,46
  Bottom 0.4: P2.1 v35.2,46
N$9
  Top 0.2: CN2.2 30.65,7.65 32.3,9.3 32.3,11.3 33.3,12.3 R4.1
N$10
  Top 0.2: CN2.3 31.3,7.7 32.7,9.1 32.7,11.1 34.4,12.8 R3.1
N$11
  Top 0.2: C16.1 R12.1
  Top 0.4: CN2.1 30,4.5 29.65,4.15 26.85,4.15 26,5 24.95,5 | 24.95,5 23.75,5 D1.A | C16.1 24.95,5
N$12
  Top 0.2: X1.3 34.65,11.2 R17.1
N$14
  Top 0.2: CN1.1 26.1,38.6 25.8,38.3 R5.1
N$15
  Top 0.2: CN1.3 25.32,41.62 25,41.3 25,38 24.6,37.6 R6.1
N$16
  Top 0.4: CN1.4 24.12,42.88 D2.A
N$17
  Top 0.2: R8.2 23,33.65 LED7.K
SW1
  Top 0.2: U3.26 37,33.6 37.4,34 38.4,34 SW1.A2
TCK  (via drill 0.3)
  Top 0.2: R2.1 28.85,12.4 25,12.4 24.73,12.67 CN3.4 24.73,15.63 v25,15.9 | v26.4,23.3 24.7,25 U3.63
  Bottom 0.2: v25,15.9 26.4,17.3 v26.4,23.3
TDI  (via drill 0.3)
  Top 0.2: CN3.8 27.27,15.63 v27,15.9 | U3.74 24,19.5 v24.1,19.6
  Bottom 0.2: v27,15.9 26.4,15.3 23.8,15.3 23.5,15.6 23.5,19 v24.1,19.6
TDO
  Top 0.2: U3.77 25.5,16.3 26,15.8 CN3.6
TMS  (via drill 0.3)
  Top 0.2: CN3.2 23.46,15.56 23.8,15.9 v24.1,15.9 | v25.8,25.4 25.8,26.3 24.1,28 U3.57
  Bottom 0.2: v24.1,15.9 26,17.8 26,22.8 25.8,23 v25.8,25.4
USB_D+
  Top 0.2: U3.95 34.5,14.65 R3.2
USB_D-
  Top 0.2: U3.94 34,15.25 R4.2
USB_VBUS
  Top 0.2: R12.2 R13.2 28.05,6.9 29.1,6.9 31,8.8 U3.88
VDDOUT  (via drill 0.3)
  Top 0.25: C23.1 39.9,30.35 39.9,29.8 39.6,29.5 U3.22 36.5,29.5 v35.7,28.7 | C7.1 40.15,27.5 U3.18 35.7,27.5 | v32,20.5 30,18.5 U3.86 30,16 30.3,15.7 C24.1 | v35.7,27.3 35.7,27.5 | 35.7,27.5 34,27.5 34,21.5 v35,20.5 U3.4 39.6,20.5 39.9,20.2 39.9,19.9 C11.1 40.6,19.55 C8.1 | v35.9,15.8 36.45,15.25 FB1.1
  Bottom 0.25: v32,20.5 v35,20.5 35.7,19.8 35.7,16 v35.9,15.8 | v35.7,28.7 v35.7,27.3
VDDPLL
  Top 0.25: U3.96 35,15.7 35.5,15.2 C13.1 C12.1 36.95,14.2 37.35,14.2 FB1.2